# EAGLE schematic HUM-ASM-001-v0-1 (EAGLE 9.5.1)

## Sheet 1 of 3: MCU
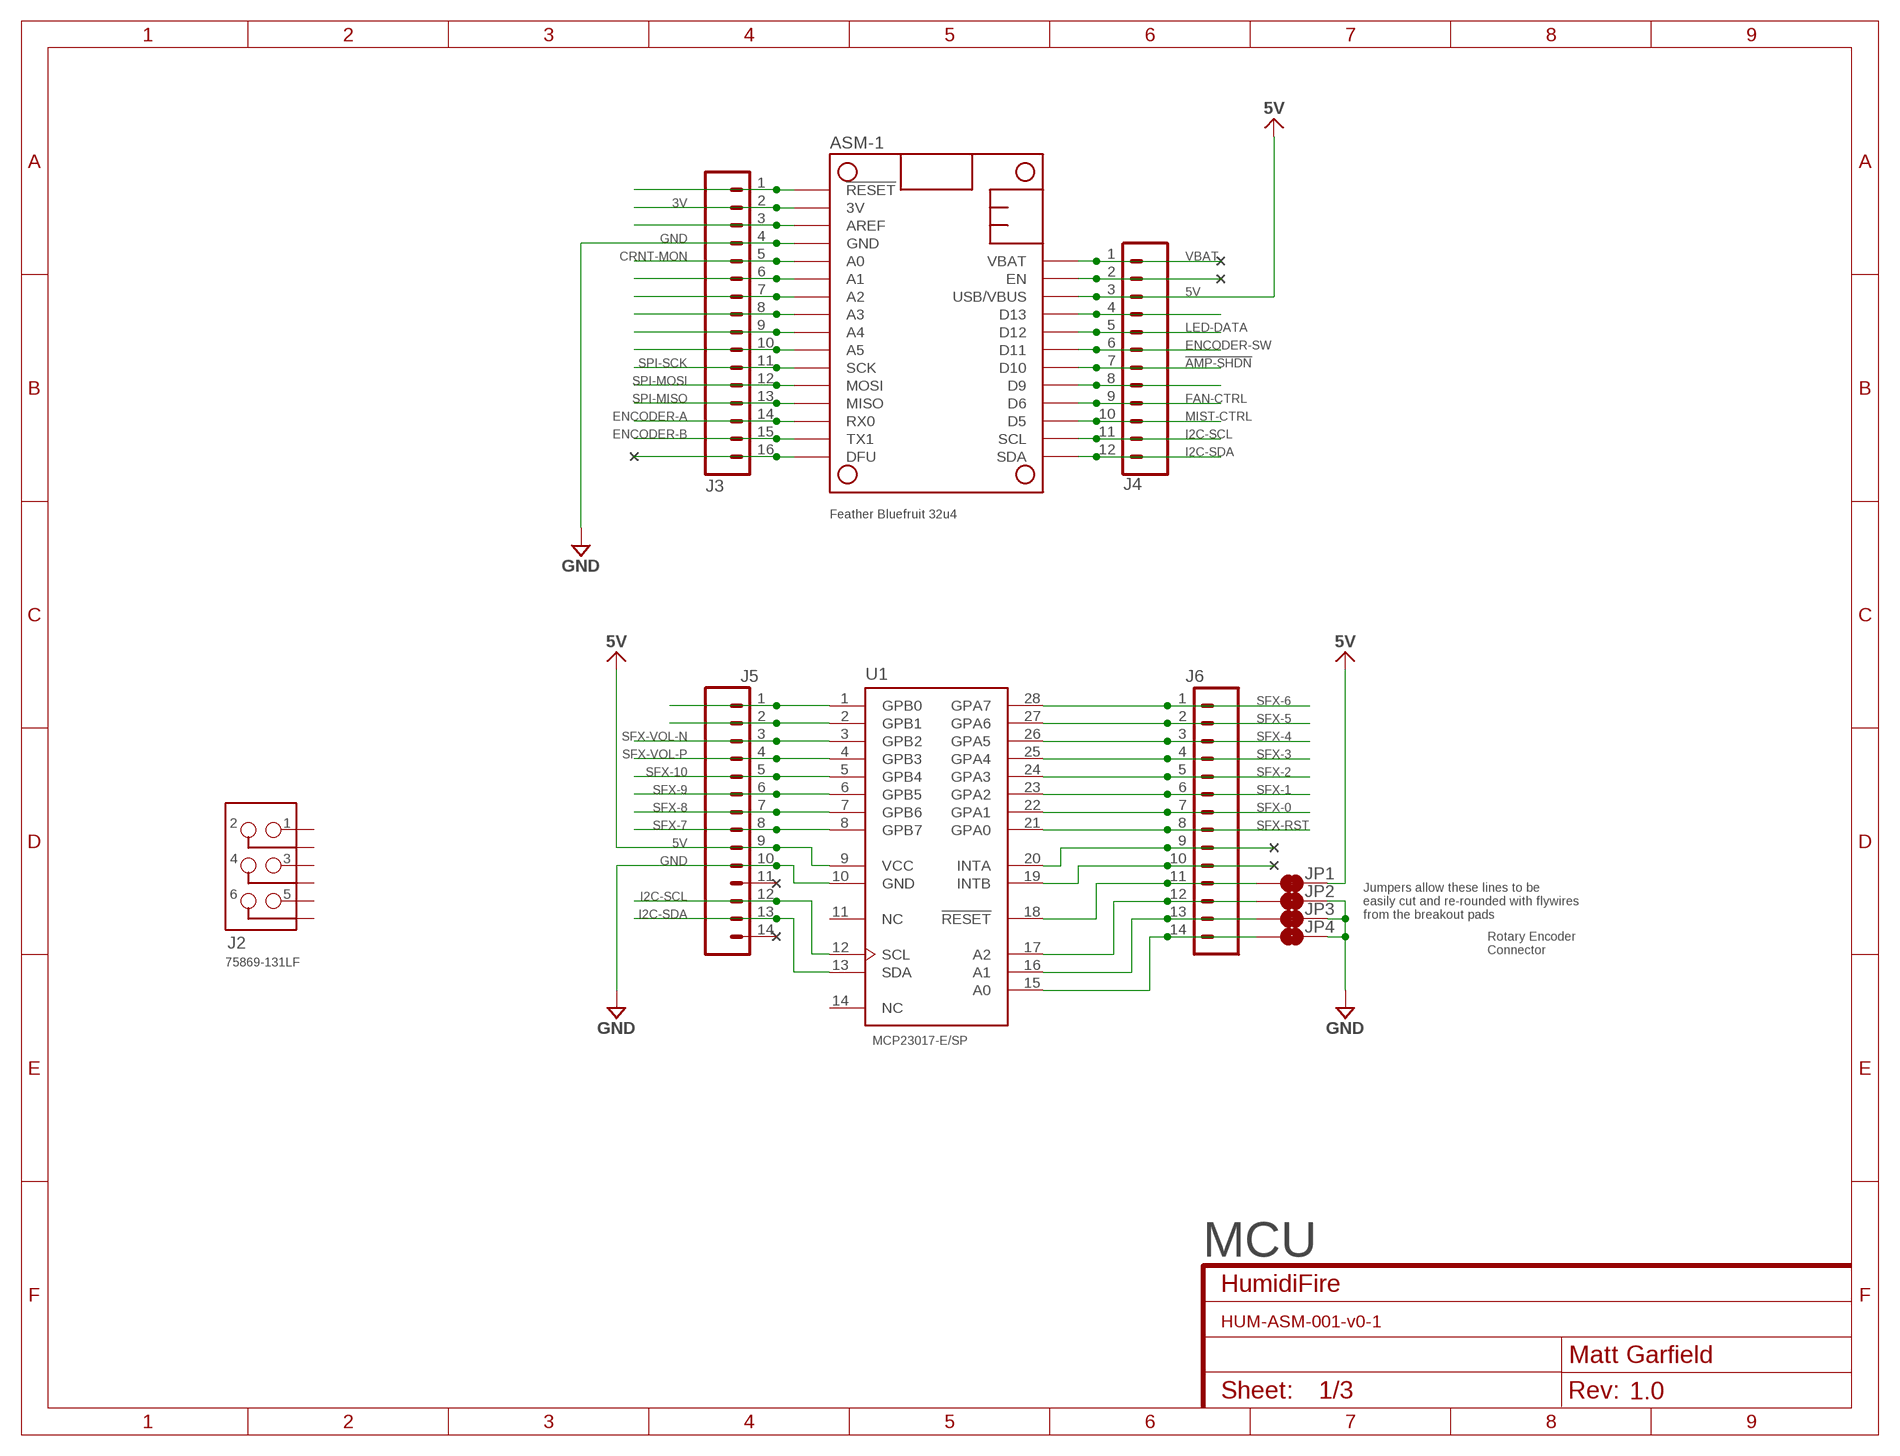
[diagram p0: schematic, sheet 1]
FRAME1 (SCH_FRAME_LETTER_8.5X11): CNAME: HumidiFire; CREVISION: 1.0; DESIGNER: Matt Garfield

### Parts
ASM-1  Feather Bluefruit 32u4  ASM_ADAFRUIT_FEATHER_BLUEFRUIT  [ASM_ADAFRUIT_FEATHER_BLUEFRUIT]
J2  75869-131LF  CON_HEADER_2X3SHROUD  [2X3-SHROUDED]
J3  CON_HEADER_1X16-1X16_NO_SILK  [1X16_NO_SILK]
J4  CON_HEADER_1X12_NO_SILK  [1X12_NO_SILK]
J5  CON_HEADER_1X14  [1X14_NO_SILK]
J6  CON_HEADER_1X14  [1X14_NO_SILK]
JP1  CON_JUMPER_PAD-2-NC_BY_TRACE  [PAD-JUMPER-2-NC_BY_TRACE_YES_SILK]
JP2  CON_JUMPER_PAD-2-NC_BY_TRACE  [PAD-JUMPER-2-NC_BY_TRACE_YES_SILK]
JP3  CON_JUMPER_PAD-2-NC_BY_TRACE  [PAD-JUMPER-2-NC_BY_TRACE_YES_SILK]
JP4  CON_JUMPER_PAD-2-NC_BY_TRACE  [PAD-JUMPER-2-NC_BY_TRACE_YES_SILK]
U1  MCP23017-E/SP  IIC_MCP23017-E/SP  [DIP787W45P254L3556H508Q28]

### Nets
3V: ASM-1.3V3(3V) J3.2
5V: ASM-1.USB/VBUS J4.3 J5.9 JP1.2 U1.9(VCC) ; supply symbol labelled V5.0 ; also sheet 2,3
!AMP-SHDN: ASM-1.D10 J4.7 ; also sheet 3
CRNT-MON: ASM-1.A0 J3.5 ; also sheet 2
DFU: ASM-1.DFU J3.16
ENCODER-A: ASM-1.RX0 J3.14
ENCODER-B: ASM-1.TX1 J3.15
ENCODER-SW: ASM-1.D11 J4.6
FAN-CTRL: ASM-1.D6 J4.9 ; also sheet 2
GND: ASM-1.GND@4(GND) J3.4 J5.10 JP2.2 JP3.2 JP4.2 U1.10(GND) ; supply symbol labelled V0_GND ; also sheet 2,3
I2C-SCL: ASM-1.SCL J4.11 J5.12 U1.12(SCL)
I2C-SDA: ASM-1.SDA J4.12 J5.13 U1.13(SDA)
LED-DATA: ASM-1.D12 J4.5
MIST-CTRL: ASM-1.D5 J4.10 ; also sheet 2
N$1: ASM-1.!RESET J3.1
N$2: ASM-1.AREF J3.3
N$3: J5.1 U1.1(GPB0)
N$4: J5.2 U1.2(GPB1)
N$5: ASM-1.A1 J3.6
N$6: ASM-1.A2 J3.7
N$7: ASM-1.A3 J3.8
N$8: ASM-1.A4 J3.9
N$9: ASM-1.A5 J3.10
N$20: ASM-1.D9 J4.8
N$24: ASM-1.D13 J4.4
N$25: ASM-1.EN J4.2
N$32: J6.9 U1.20(INTA)
N$33: J6.10 U1.19(INTB)
N$34: J6.11 JP1.1 U1.18(!RESET)
N$35: J6.12 JP2.1 U1.17(A2)
N$36: J6.13 JP3.1 U1.16(A1)
N$37: J6.14 JP4.1 U1.15(A0)
SFX-0: J6.7 U1.22(GPA1) ; also sheet 3
SFX-1: J6.6 U1.23(GPA2) ; also sheet 3
SFX-2: J6.5 U1.24(GPA3) ; also sheet 3
SFX-3: J6.4 U1.25(GPA4) ; also sheet 3
SFX-4: J6.3 U1.26(GPA5) ; also sheet 3
SFX-5: J6.2 U1.27(GPA6) ; also sheet 3
SFX-6: J6.1 U1.28(GPA7) ; also sheet 3
SFX-7: J5.8 U1.8(GPB7) ; also sheet 3
SFX-8: J5.7 U1.7(GPB6) ; also sheet 3
SFX-9: J5.6 U1.6(GPB5) ; also sheet 3
SFX-10: J5.5 U1.5(GPB4) ; also sheet 3
SFX-RST: J6.8 U1.21(GPA0) ; also sheet 3
SFX-VOL-N: J5.3 U1.3(GPB2) ; also sheet 3
SFX-VOL-P: J5.4 U1.4(GPB3) ; also sheet 3
SPI-MISO: ASM-1.MISO J3.13
SPI-MOSI: ASM-1.MOSI J3.12
SPI-SCK: ASM-1.SCK J3.11
VBAT: ASM-1.VBAT J4.1
Unconnected: J2.1 J2.2 J2.3 J2.4 J2.5 J2.6 J5.11 J5.14 U1.11(NC) U1.14(NC)

### Notes on the sheet
- Jumpers allow these lines to be
  easily cut and re-rounded with flywires 
  from the breakout pads
- Rotary Encoder
  Connector
- MCU

## Sheet 2 of 3: Power
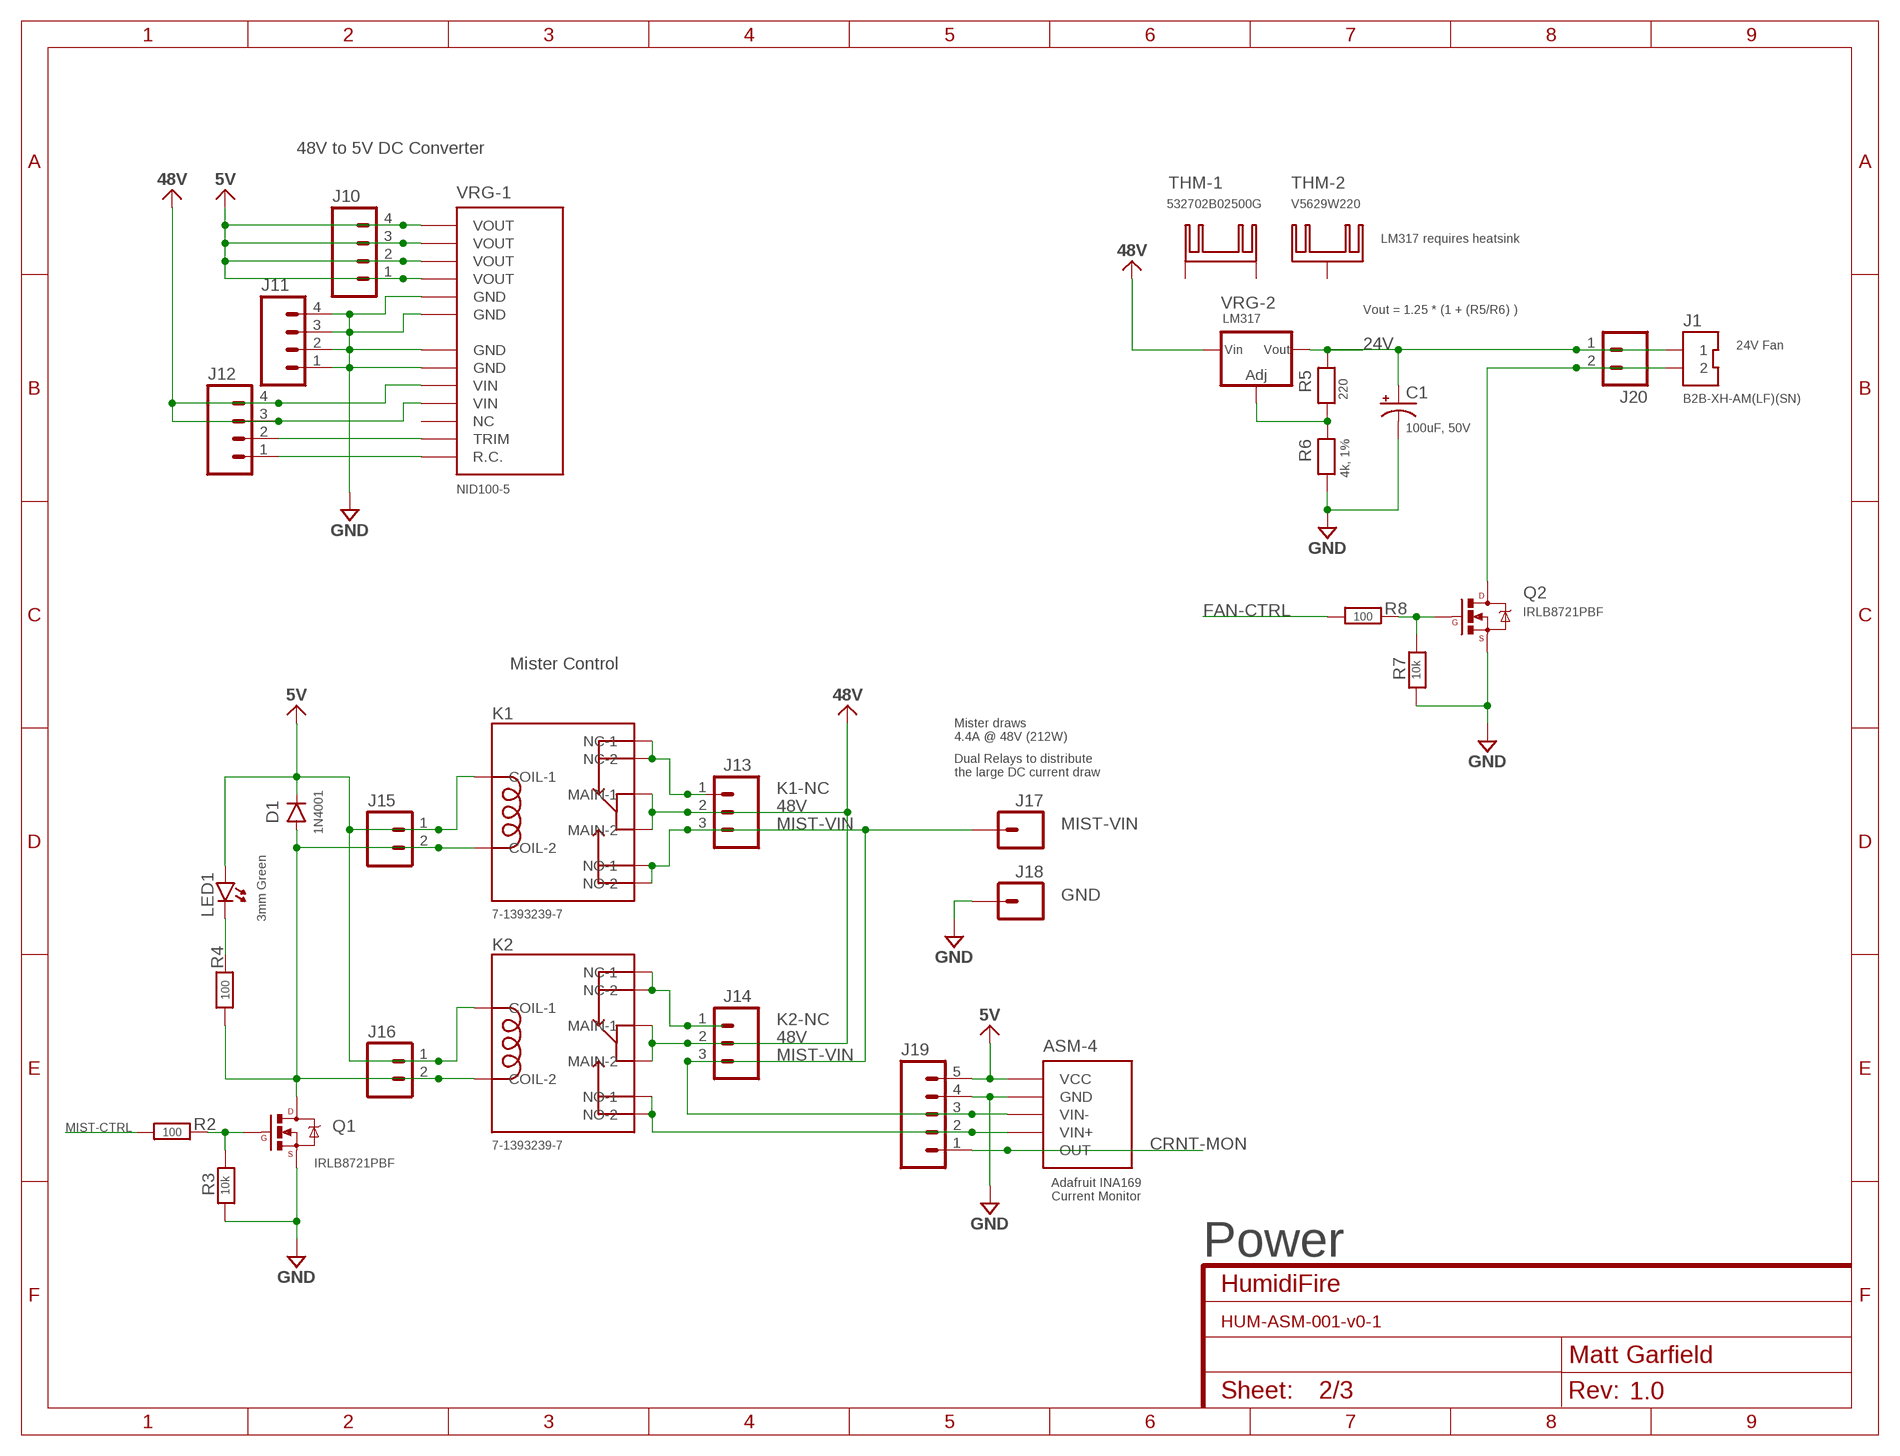
[diagram p1: schematic, sheet 2]
FRAME4 (SCH_FRAME_LETTER_8.5X11): CNAME: HumidiFire; CREVISION: 1.0; DESIGNER: Matt Garfield

### Parts
ASM-4  ASM_ADAFRUIT_INA169  [ASM_ADAFRUIT_INA169_MOUNTING_HOLES]
C1  100uF, 50V  CAP_THT_POL-E-035X080MM  [CAP_E-035X080]
D1  1N4001  DIO_DIODEPTH  [DIODE-1N4001]
J1  B2B-XH-AM(LF)(SN)  CON_JST_2-PIN_B2B-XH-AM  [JST-2-PTH-VERT_XH]
J10  CON_HEADER_1X4NO_SILK_ALL_ROUND  [1X04_NO_SILK_ALL_ROUND]
J11  CON_HEADER_1X4NO_SILK_ALL_ROUND  [1X04_NO_SILK_ALL_ROUND]
J12  CON_HEADER_1X4NO_SILK_ALL_ROUND  [1X04_NO_SILK_ALL_ROUND]
J13  CON_HEADER_1X31X03_NO_SILK  [1X03_NO_SILK]
J14  CON_HEADER_1X31X03_NO_SILK  [1X03_NO_SILK]
J15  CON_HEADER_1X21X02_NO_SILK  [1X02_NO_SILK]
J16  CON_HEADER_1X21X02_NO_SILK  [1X02_NO_SILK]
J17  CON_HEADER_1X1-QC_TAB_121786-1  [TE_1217861-1]
J18  CON_HEADER_1X1-QC_TAB_121786-1  [TE_1217861-1]
J19  CON_HEADER_1X5NO_SILK  [1X05_NO_SILK]
J20  CON_HEADER_1X21X02_NO_SILK  [1X02_NO_SILK]
K1  7-1393239-7  EMD_RELAY_SPDT_8-PIN_TE_7-1393239-7  [RELAY_TE_7-1393239-7]
K2  7-1393239-7  EMD_RELAY_SPDT_8-PIN_TE_7-1393239-7  [RELAY_TE_7-1393239-7]
LED1  3mm Green  LED_THT-3MM  [LED3MM]
Q1  IRLB8721PBF  TRN_MOSFET-N_TO-220_VERTICAL  [TO-220-VERTICAL]
Q2  IRLB8721PBF  TRN_MOSFET-N_TO-220_VERTICAL  [TO-220-VERTICAL]
R2  100  RES_RESISTOR-PTH-1/4W  [AXIAL-0.4]
R3  10k  RES_RESISTOR-PTH-1/4W  [AXIAL-0.4]
R4  100  RES_RESISTOR-PTH-1/4W  [AXIAL-0.4]
R5  220  RES_RESISTOR-PTH-1/4W  [AXIAL-0.4]
R6  4k, 1%  RES_RESISTOR-PTH-1/4W  [AXIAL-0.4]
R7  10k  RES_RESISTOR-PTH-1/4W  [AXIAL-0.4]
R8  100  RES_RESISTOR-PTH-1/4W  [AXIAL-0.4]
THM-1  532702B02500G  THM_HEATSINK_2-PIN  [HEATSINK_AAVID_532XX]
THM-2  V5629W220  THM_HEATSINK_1-PIN  [SK95-2M3]
VRG-1  NID100-5  VRG_NID100  [VRG_NID100-X]
VRG-2  LM317  VRG_LM317_TO-220_VERTICAL  [TO-220-VERTICAL]

### Nets
5V: ASM-4.1(VCC) D1.C J10.1 J10.2 J10.3 J10.4 J15.1 J16.1 J19.5 K1.COIL-1 K2.COIL-1 LED1.A VRG-1.P$1(VOUT) VRG-1.P$2(VOUT) VRG-1.P$3(VOUT) VRG-1.P$4(VOUT) ; supply symbol labelled V5.0 ; also sheet 1,3
24V: C1.+ J1.1 J20.1 R5.P$2(P2) VRG-2.P2(VOUT)
48V: J12.3 J12.4 J13.2 J14.2 K1.MAIN-1 K1.MAIN-2 K2.MAIN-1 K2.MAIN-2 VRG-1.P$9(VIN) VRG-1.P$10(VIN) VRG-2.P3(VIN) ; supply symbol labelled V48
ADJ: R5.P$1(P1) R6.P$2(P2) VRG-2.P1(ADJ)
CRNT-MON: ASM-4.5(OUT) J19.1 ; also sheet 1
FAN-CTRL: R8.P$1(P1) ; also sheet 1
GND: ASM-4.2(GND) C1.- J11.1 J11.2 J11.3 J11.4 J18.1 J18.2 J19.4 Q1.P3(S) Q2.P3(S) R3.P$2(P2) R6.P$1(P1) R7.P$2(P2) VRG-1.P$5(GND) VRG-1.P$6(GND) VRG-1.P$7(GND) VRG-1.P$8(GND) ; supply symbol labelled V0_GND ; also sheet 1,3
K1-NC: J13.1 K1.NC-1 K1.NC-2
K2-NC: J14.1 K2.NC-1 K2.NC-2
MIST-CTRL: R2.P$1(P1) ; also sheet 1
MIST-VIN: ASM-4.3(VIN-) J13.3 J14.3 J17.1 J17.2 J19.3 K1.NO-1 K1.NO-2
N$10: D1.A J15.2 J16.2 K1.COIL-2 K2.COIL-2 Q1.P2(D) R4.P$1(P1)
N$11: Q1.P1(G) R2.P$2(P2) R3.P$1(P1)
N$12: J1.2 J20.2 Q2.P2(D)
N$13: LED1.K(C) R4.P$2(P2)
N$16: ASM-4.4(VIN+) J19.2 K2.NO-1 K2.NO-2
N$17: Q2.P1(G) R7.P$1(P1) R8.P$2(P2)
N$27: J12.1 VRG-1.P$13(R.C.)
N$29: J12.2 VRG-1.P$12(TRIM)
Unconnected: THM-1.1(K) THM-1.2(K) THM-2.P$1(K) VRG-1.P$11(NC)

### Notes on the sheet
- 48V to 5V DC Converter
- LM317 requires heatsink
- Vout = 1.25 * (1 + (R5/R6) )
- 24V Fan
- Mister Control
- Mister draws 
  4.4A @ 48V (212W)
- Dual Relays to distribute
  the large DC current draw
- Power

## Sheet 3 of 3: Audio
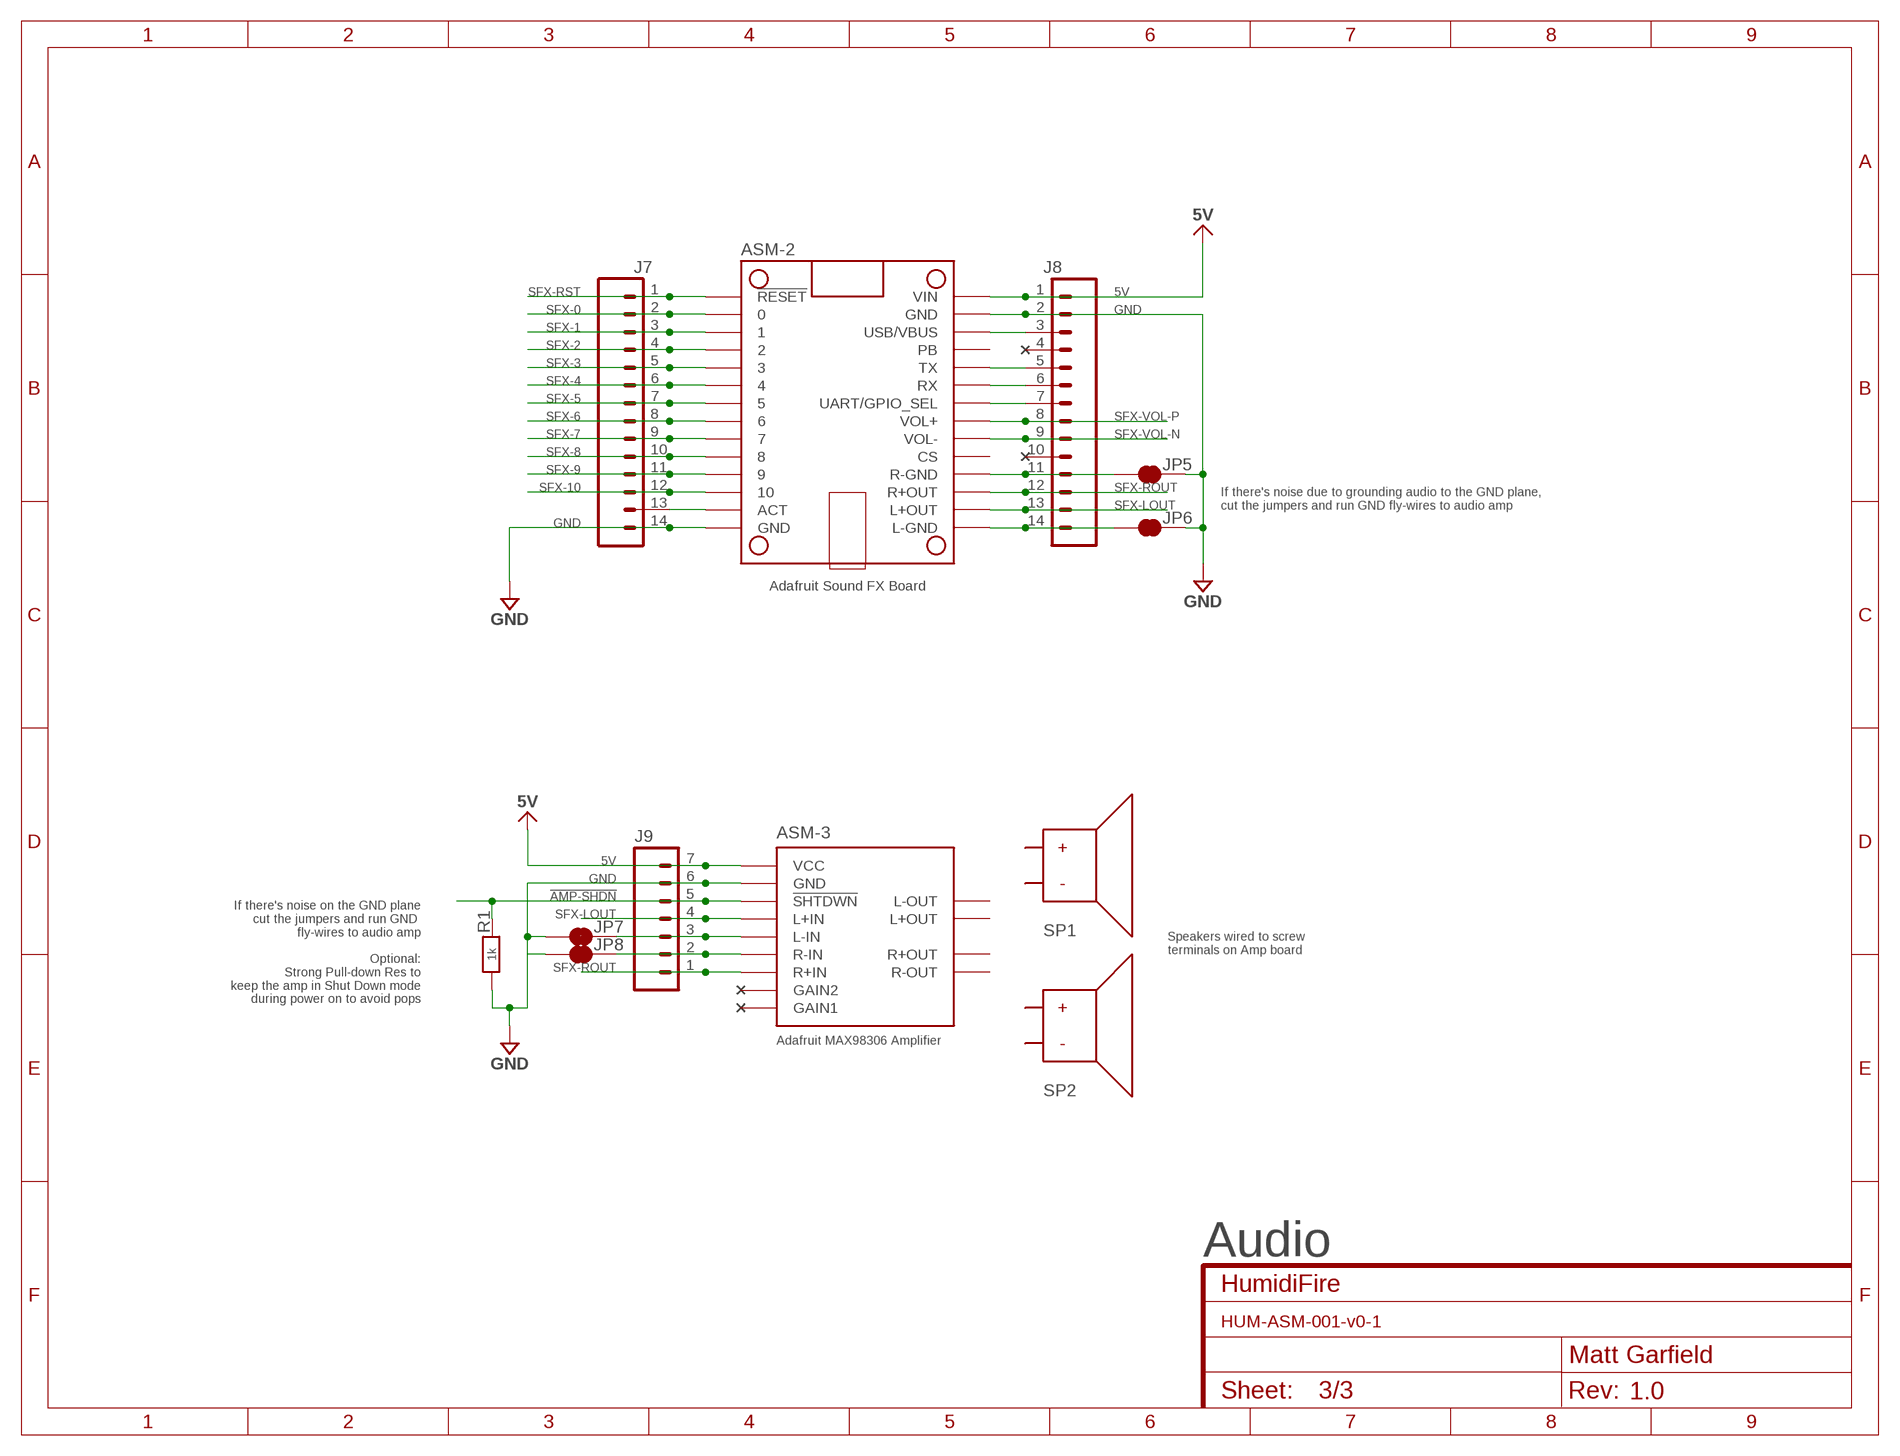
[diagram p2: schematic, sheet 3]
FRAME2 (SCH_FRAME_LETTER_8.5X11): CNAME: HumidiFire; CREVISION: 1.0; DESIGNER: Matt Garfield

### Parts
ASM-2  ASM_ADAFRUIT_SOUND_FX_BOARD  [ASM_ADAFRUIT_SOUND_FX_BOARD]
ASM-3  ASM_ADAFRUIT_MAX98306_AMP  [ASM_ADAFRUIT_MAX98306_AMP_MOUNTING_HOLES]
J7  CON_HEADER_1X14  [1X14_NO_SILK]
J8  CON_HEADER_1X14  [1X14_NO_SILK]
J9  CON_HEADER_1X7NO_SILK  [1X07_NO_SILK]
JP5  CON_JUMPER_PAD-2-NC_BY_TRACE  [PAD-JUMPER-2-NC_BY_TRACE_YES_SILK]
JP6  CON_JUMPER_PAD-2-NC_BY_TRACE  [PAD-JUMPER-2-NC_BY_TRACE_YES_SILK]
JP7  CON_JUMPER_PAD-2-NC_BY_TRACE  [PAD-JUMPER-2-NC_BY_TRACE_YES_SILK]
JP8  CON_JUMPER_PAD-2-NC_BY_TRACE  [PAD-JUMPER-2-NC_BY_TRACE_YES_SILK]
R1  1k  RES_RESISTOR-PTH-1/4W  [AXIAL-0.4]

### Nets
5V: ASM-2.28(VIN) ASM-3.1(VCC) J8.1 J9.7 ; supply symbol labelled V5.0 ; also sheet 1,2
!AMP-SHDN: ASM-3.3(!SHTDWN) J9.5 R1.P$2(P2) ; also sheet 1
GND: ASM-2.14(GND) ASM-2.27(GND) ASM-3.2(GND) J7.14 J8.2 J9.6 JP5.2 JP6.2 JP7.1 JP8.1 R1.P$1(P1) ; supply symbol labelled V0_GND ; also sheet 1,2
N$14: ASM-3.5(L-IN) J9.3 JP7.2
N$15: ASM-3.6(R-IN) J9.2 JP8.2
N$26: ASM-2.13(ACT) J7.13
N$28: ASM-2.18(R-GND) J8.11 JP5.1
N$30: ASM-2.24(TX) J8.5
N$31: ASM-2.23(RX) J8.6
N$38: ASM-2.22(UART/GPIO_SEL) J8.7
N$44: ASM-2.15(L-GND) J8.14 JP6.1
SFX-0: ASM-2.2 J7.2 ; also sheet 1
SFX-1: ASM-2.3 J7.3 ; also sheet 1
SFX-2: ASM-2.4 J7.4 ; also sheet 1
SFX-3: ASM-2.5 J7.5 ; also sheet 1
SFX-4: ASM-2.6 J7.6 ; also sheet 1
SFX-5: ASM-2.7 J7.7 ; also sheet 1
SFX-6: ASM-2.8 J7.8 ; also sheet 1
SFX-7: ASM-2.9 J7.9 ; also sheet 1
SFX-8: ASM-2.10 J7.10 ; also sheet 1
SFX-9: ASM-2.11 J7.11 ; also sheet 1
SFX-10: ASM-2.12 J7.12 ; also sheet 1
SFX-LOUT: ASM-2.16(L+OUT) ASM-3.4(L+IN) J8.13 J9.4
SFX-ROUT: ASM-2.17(R+OUT) ASM-3.7(R+IN) J8.12 J9.1
SFX-RST: ASM-2.1(!RESET) J7.1 ; also sheet 1
SFX-VOL-N: ASM-2.20(VOL-) J8.9 ; also sheet 1
SFX-VOL-P: ASM-2.21(VOL+) J8.8 ; also sheet 1
USB/VBUS: ASM-2.26(USB/VBUS) J8.3
Unconnected: ASM-2.19(CS) ASM-2.25(PB) ASM-3.8(GAIN2) ASM-3.9(GAIN1) ASM-3.12(L-OUT) ASM-3.13(L+OUT) ASM-3.14(R+OUT) ASM-3.15(R-OUT) J8.4 J8.10

### Notes on the sheet
- If there's noise due to grounding audio to the GND plane, 
  cut the jumpers and run GND fly-wires to audio amp
- If there's noise on the GND plane
  cut the jumpers and run GND 
  fly-wires to audio amp
- Optional:
  Strong Pull-down Res to
  keep the amp in Shut Down mode
  during power on to avoid pops
- Speakers wired to screw 
  terminals on Amp board
- Audio

## Library data of the parts
ASM-1 = MG-Eagle_v1:ASM_ADAFRUIT_FEATHER_BLUEFRUIT
ASM-2 = MG-Eagle_v1:ASM_ADAFRUIT_SOUND_FX_BOARD
ASM-3 = MG-Eagle_v1:ASM_ADAFRUIT_MAX98306_AMP
ASM-4 = MG-Eagle_v1:ASM_ADAFRUIT_INA169
C1 = MG-Eagle_v1:CAP_THT_POL: Capacitor Standard 0603 ceramic capacitor, and 0.1" leaded capacitor.
D1 = MG-Eagle_v1:DIO_DIODE: Diode These are standard reverse protection diodes and small signal diodes. SMA package can handle up to about 1A. SOD-323 can handle about 200mA. What the SOD-323 package when ordering, there are some mfgs out there that are 5-pin packages.
J1 = MG-Eagle_v1:CON_JST_2-PIN
J2 = MG-Eagle_v1:CON_HEADER_2X3: 2x3 .1" header.; PROD_ID: CONN-10681
J3 = MG-Eagle_v1:CON_HEADER_1X16: 1x16 .1" header
J4 = MG-Eagle_v1:CON_HEADER_1X12
J5-J8 = MG-Eagle_v1:CON_HEADER_1X14
J9 = MG-Eagle_v1:CON_HEADER_1X7: Header 7 Standard 7-pin 0.1" header. Use with straight break away headers (SKU : PRT-00116), right angle break away headers (PRT-00553), swiss pins (PRT-00743), machine pins (PRT-00117), and female headers (PRT-00115). NOTES ON THE VARIANTS LOCK and LOCK_LONGPADS... This footprint was designed to help hold the alignment of a through-hole component (i.e. 7-pin header) while soldering it into place. You may notice that each hole has been shifted either up or down by 0.005 of an inch from it's more standard position (which is usually a perfectly straight line). This slight alteration caused the pins (the squares in the middle) to touch the edges of the holes. Because they are alternating, it causes a "brace" to hold the header in place. 0.005 has proven to be the perfect amount of "off-center" position when using our standard breakaway headers. Although looks a little odd when you look at the bare footprint, once you have a header in there, the alteration is very hard to notice. Also, if you push a header all the way into place, it is covered up entirely on the bottom side. This idea of altering the position of holes to aid alignment will be further integrated into the Sparkfun Library for other footprints. It can help hold any component with 3 or more connection pins.
J10-J12 = MG-Eagle_v1:CON_HEADER_1X4: Header 4 Standard 4-pin 0.1" header. Use with straight break away headers (SKU : PRT-00116), right angle break away headers (PRT-00553), swiss pins (PRT-00743), machine pins (PRT-00117), and female headers (PRT-00115). Molex polarized connector foot print use with SKU : PRT-08231 with associated crimp pins and housings. 1MM SMD Version SKU: PRT-10208; PROD_ID: CONN-09696
J13 J14 = MG-Eagle_v1:CON_HEADER_1X3: Header 3 Standard 3-pin 0.1" header. Use with straight break away headers (SKU : PRT-00116), right angle break away headers (PRT-00553), swiss pins (PRT-00743), machine pins (PRT-00117), and female headers (PRT-00115). Molex polarized connector foot print use with SKU : PRT-08232 with associated crimp pins and housings.
J15 J16 J20 = MG-Eagle_v1:CON_HEADER_1X2: Standard 2-pin 0.1" header. Use with - straight break away headers ( PRT-00116) - right angle break away headers (PRT-00553) - swiss pins (PRT-00743) - machine pins (PRT-00117) - female headers (PRT-00115) Molex polarized connector foot print use with: PRT-08233 with associated crimp pins and housings. 2.54_SCREWTERM for use with PRT-10571. 3.5mm Screw Terminal footprints for PRT-08084 5mm Screw Terminal footprints for use with PRT-08432
J17 J18 = MG-Eagle_v1:CON_HEADER_1X1: Header 1 Standard 1-pin 0.1" header. Use with straight break away headers (SKU : PRT-00116), right angle break away headers (PRT-00553), swiss pins (PRT-00743), machine pins (PRT-00117), and female headers (PRT-00115). SMTSO-256-ET is a "flush mount" nut for a 4-40 screw. The older package used to be too tight, and did not allow it to sit properly thru the drill hit. The latest (0.165DIA) fits nice and snug.
J19 = MG-Eagle_v1:CON_HEADER_1X5: Header 5 Standard 5-pin 0.1" header. Use with straight break away headers (SKU : PRT-00116), right angle break away headers (PRT-00553), swiss pins (PRT-00743), machine pins (PRT-00117), and female headers (PRT-00115). Molex polarized connector foot print use with SKU : PRT-08230 with associated crimp pins and housings.
JP1-JP8 = MG-Eagle_v1:CON_JUMPER_PAD-2-NC_BY_TRACE
K1 K2 = MG-Eagle_v1:EMD_RELAY_SPDT_8-PIN
LED1 = MG-Eagle_v1:LED_THT: LEDs Standard schematic elements and footprints for 5mm, 3mm, 1206, and 0603 sized LEDs. 5mm - Spark Fun Electronics SKU : COM-00529 (and others); PROD_ID: DIO-08794
Q1 Q2 = MG-Eagle_v1:TRN_MOSFET-N: Common NMOSFET Parts MFG P/N Store ID Prod ID FDD8780 TRANS-09984 SI7820DN TRANS-11055 FDS6630A IC-08089 2N7002PW TRANS-11151 FQP30N06L COM-10213 TRANS-10060 BSS123LT1G TRANS-08345 BSS138 TRANS-00830 BS170 2N7000; PROD_ID: TRANS-10060
R1-R8 = MG-Eagle_v1:RES_RESISTOR: Resistor Basic schematic elements and footprints for 0603, 1206, and PTH resistors.
THM-1 = MG-Eagle_v1:THM_HEATSINK_2-PIN: HEATSINK manufacturer Fischer/distributor Buerklin
THM-2 = MG-Eagle_v1:THM_HEATSINK_1-PIN: HEATSINK manufacturer Fischer/distributor Buerklin
U1 = MG-Eagle_v1:IIC_MCP23017-E/SP: MCP23017 Series 5.5 V 1.7 MHz SMT 16-Bit I2C I/O Expander - SPDIP-28; DESCRIPTION: MCP23017 Series 5.5 V 1.7 MHz SMT 16-Bit I2C I/O Expander - SPDIP-28; DIGI-KEY_PART_NUMBER: MCP23017-E/SP-ND; DIGI-KEY_PURCHASE_URL: https://www.digikey.com/product-detail/en/microchip-technology/MCP23017-E-SP/MCP23017-E-SP-ND/894272?utm_source=snapeda&utm_medium=aggregator&utm_campaign=symbol; MF: Microchip; MP: MCP23017-E/SP; PACKAGE: DIP-28 Microchip
VRG-1 = MG-Eagle_v1:VRG_NID100
VRG-2 = MG-Eagle_v1:VRG_LM317